# EasyEDA schematic SCH_手持安全出口指示牌_2025-09-30.json
TITLE: Sheet_1; REV: 1.0; Date: 2024-11-24; Sheet: 1/1; Drawn By: hongliu114; Company: Your Company
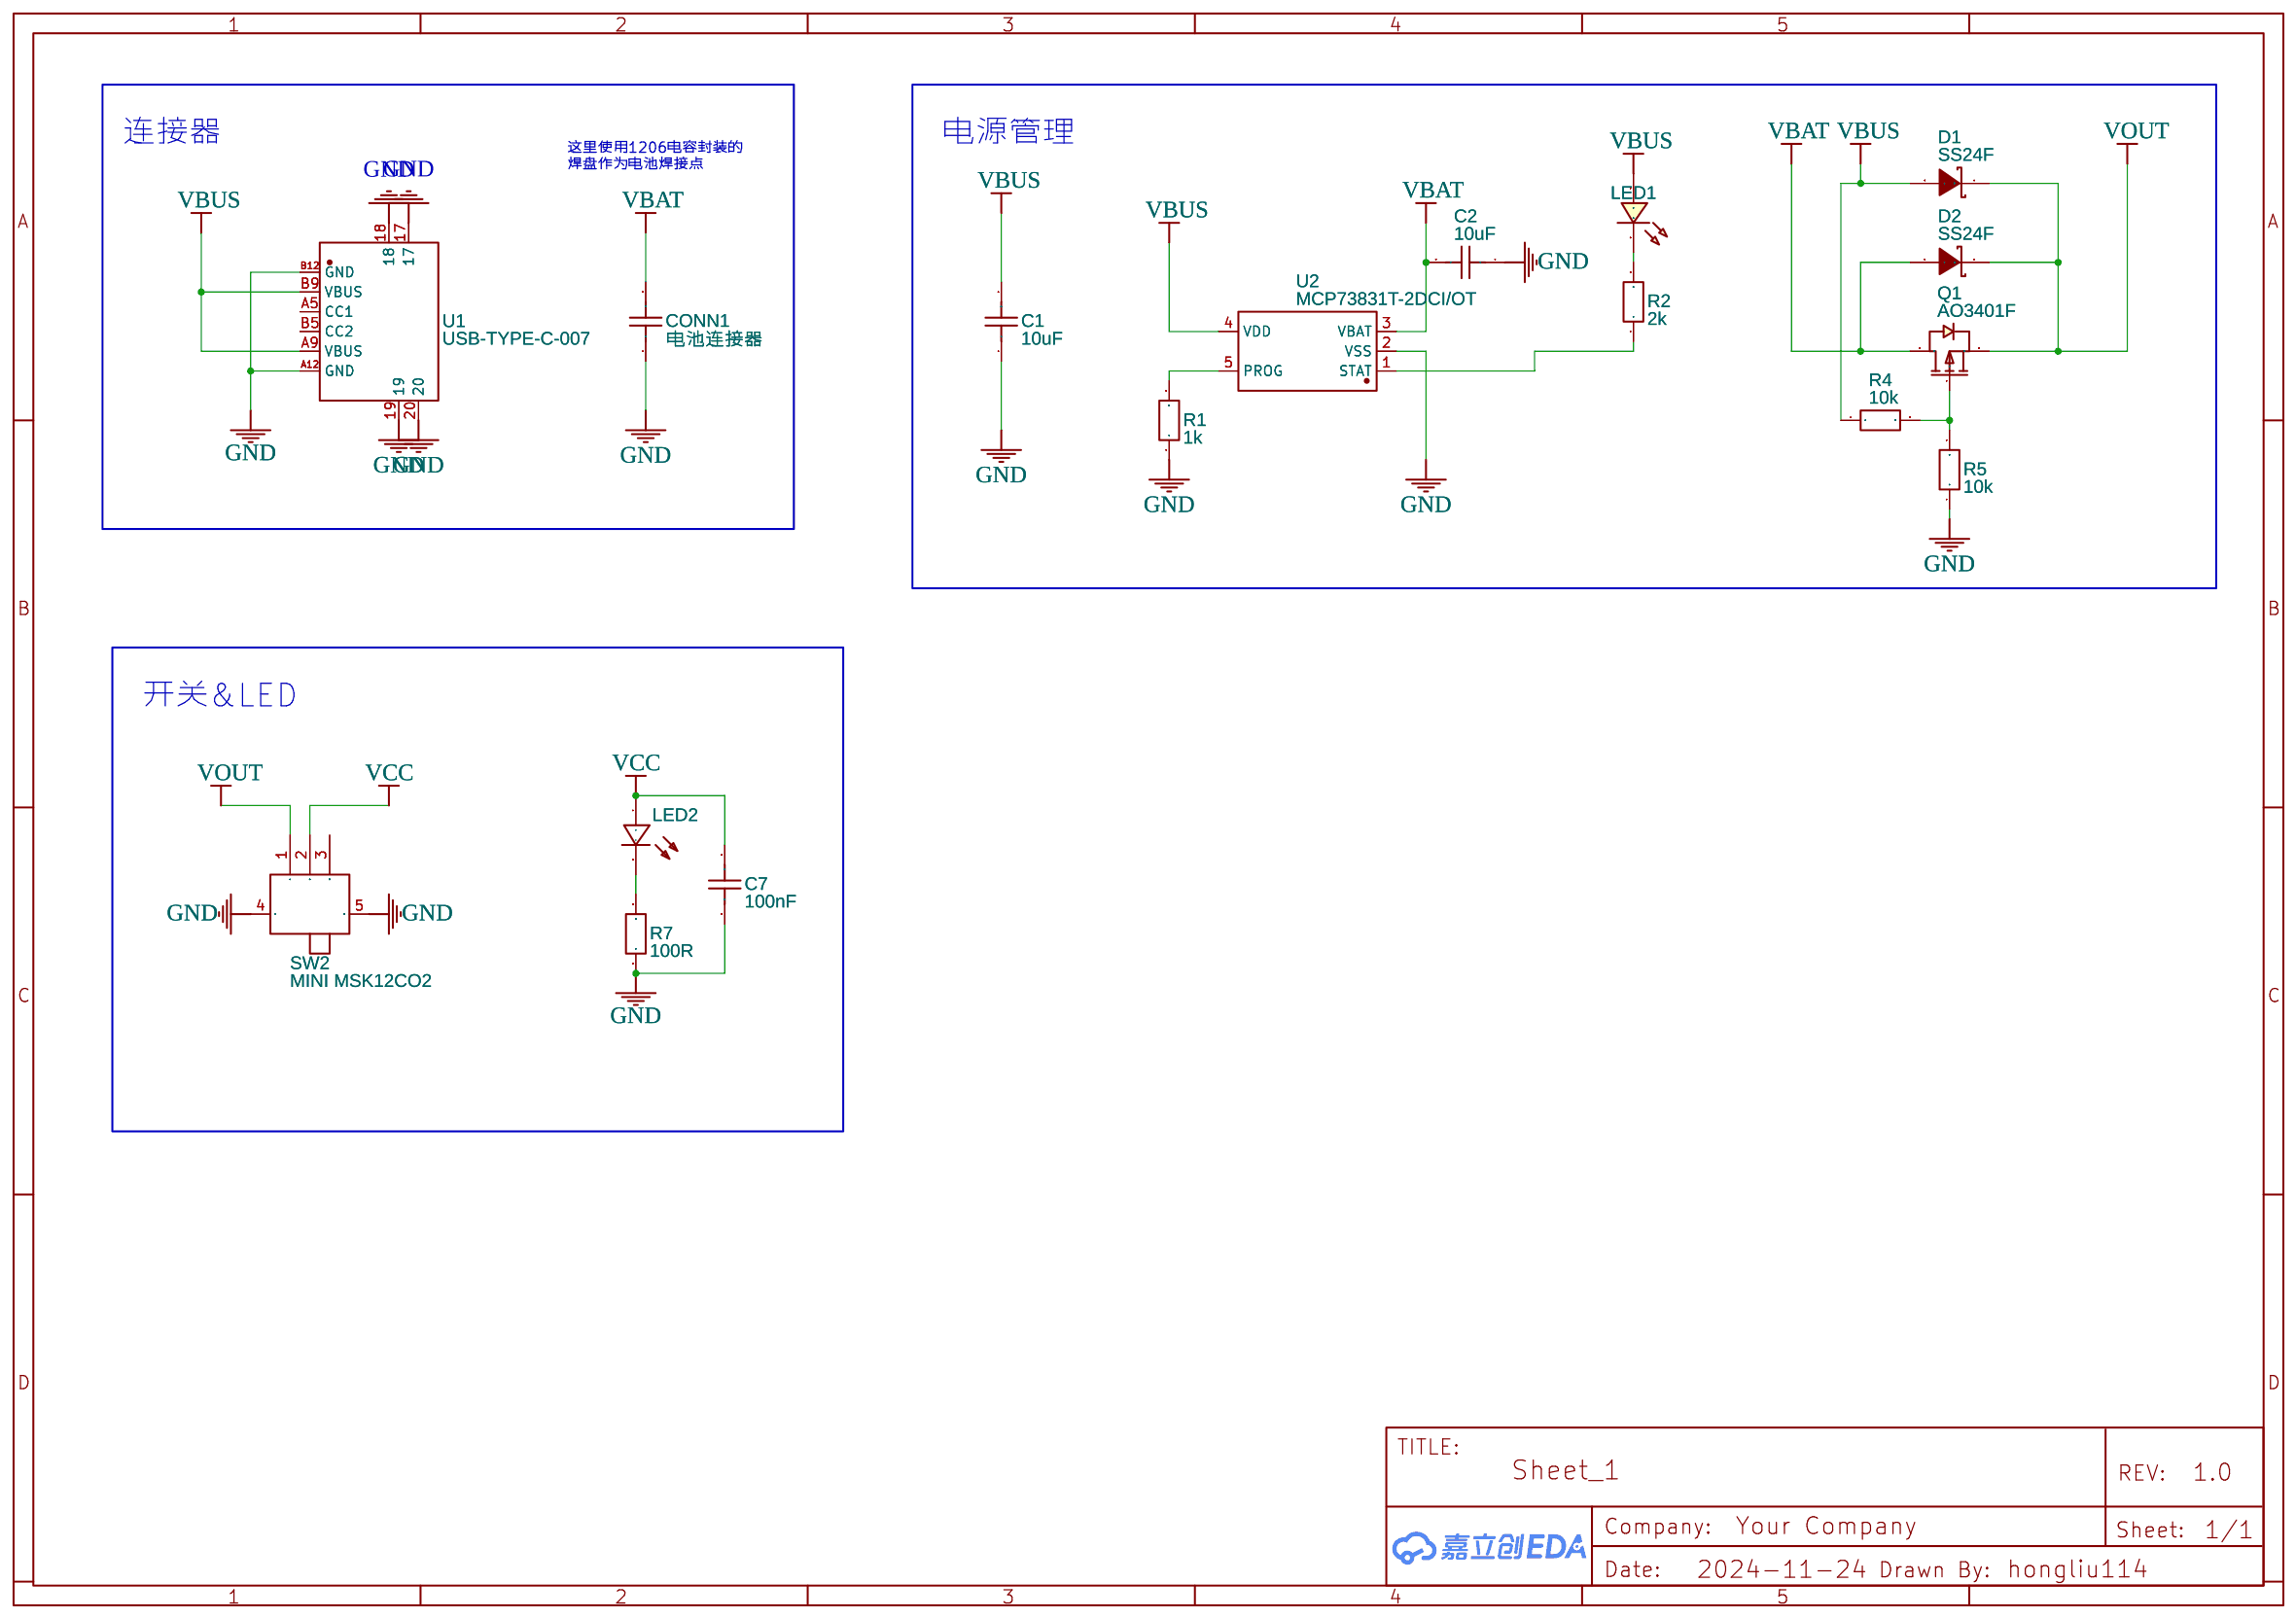
[diagram p0: schematic sheet]

## Parts
C1  10uF  [C0603]
C2  10uF  [C0603]
C7  100nF  [C0603]
CONN1  电池连接器  [C1206]
D1  SS24F  [SMAF_L3.5-W2.6-LS4.7-RD]
D2  SS24F  [SMAF_L3.5-W2.6-LS4.7-RD]
LED1  LED-0603_G  [LED0603_RED]
LED2  LED陶瓷灯丝(26MM)  [LED陶瓷灯丝(26MM)]
Q1  AO3401F  [SOT-23-3_L2.9-W1.3-P1.90-LS2.4-BR]
R1  1k  [R0603]
R2  2k  [R0603]
R4  10k  [R0603]
R5  10k  [R0603]
R7  100R  [R0603]
SW2  MINI MSK12CO2  [SW-SMD_MSK12CO2]
U1  USB-TYPE-C-007  [TYPE-C-SMD_USB-TYPE-C-007]
U2  MCP73831T-2DCI/OT  [SOT-23-5_L2.9-W1.6-P0.95-LS2.8-BL]

## Library data of the parts
C1 C2 C7 = C_0603_US: Contributor: LCEDA_Lib
CONN1 = C1206X119D8HACAUTO: Supplier: LCSC; Supplier Part: C7223769; Manufacturer: KEMET(基美); JLCPCB Part Class: Extended Part; Contributor: lcsc
D1 D2 = SS24F: Supplier: LCSC; Manufacturer: 晶导微电子; Supplier Part: C108834; JLCPCB Part Class: Extended Part
LED1 = LED-0603_R: Manufacturer: EVERLIGHT(台湾亿光); Manufacturer Part: 19-217/R6C-AL1M2VY/3T; Supplier Part: C72044; Supplier: LCSC; Contributor: LCEDA_01
LED2 = LED陶瓷灯丝(26MM): Supplier: 淘宝
Q1 = AO3401F: Contributor: lcsc; Supplier: LCSC; Supplier Part: C5439976; Manufacturer: BORN(伯恩半导体); JLCPCB Part Class: Extended Part
R1 R2 R4 R5 R7 = R_0603_EU: Contributor: LCEDA_Lib
SW2 = MINI MSK12CO2: Supplier: LCSC; Supplier Part: C2681570; Manufacturer: SHOU HAN(首韩); Contributor: 日月铭; JLCPCB Part Class: Extended Part
U1 = USB-TYPE-C-007: Contributor: lcsc; Supplier: LCSC; Supplier Part: C2927027; Manufacturer: DEALON(德艺隆); JLCPCB Part Class: Extended Part
U2 = MCP73831T-2DCI/OT: Contributor: LCSC; Supplier: LCSC; Supplier Part: C625597; Manufacturer: MICROCHIP(美国微芯); JLCPCB Part Class: Extended Part

## Nets
GND: C1.1 C2.1 C7.2 CONN1.1 R1.1 R5.1 R7.1 SW2.4 SW2.5 U1.17 U1.18 U1.19 U1.20 U1.A12(GND) U1.B12(GND) U2.2(VSS)
VBAT: C2.2 CONN1.2 D2.2(A) Q1.3(D) U2.3(VBAT)
VBUS: C1.2 D1.2(A) LED1.1 R4.1 U1.A9(VBUS) U1.B9(VBUS) U2.4(VDD)
VCC: C7.1 LED2.1(+) SW2.2
VOUT: D1.1(C) D2.1(C) Q1.2(S) SW2.1
Net-(LED1-2): LED1.2 R2.2
Net-(LED2-2): LED2.2(-) R7.2
Net-(Q1-1): Q1.1(G) R4.2 R5.2
Net-(R1-2): R1.2 U2.5(PROG)
Net-(R2-1): R2.1 U2.1(STAT)

Not connected (* = marked no-connect by the designer): SW2 3; U1 A5(CC1) B5(CC2)

## Notes on the sheet
- 连接器
- 这里使用1206电容封装的
  焊盘作为电池焊接点
- 电源管理
- 开关&LED
